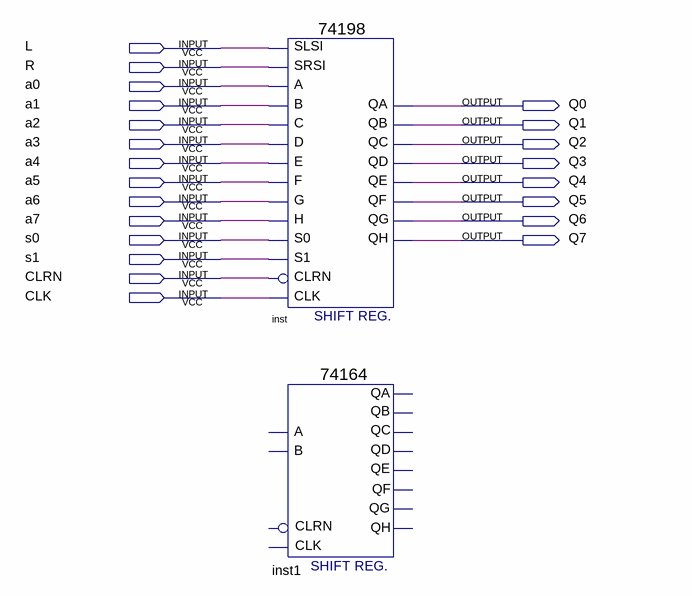
[diagram p0: schematic sheet]
// Quartus schematic mov.bdf as structural Verilog: 2 symbols, 22 pins
module mov (
  input  L,
  input  R,
  input  a0,
  input  a1,
  input  a2,
  input  a3,
  input  a4,
  input  a5,
  input  a6,
  input  a7,
  input  s0,
  input  s1,
  input  CLRN,
  input  CLK,
  output Q0,
  output Q1,
  output Q2,
  output Q3,
  output Q4,
  output Q5,
  output Q6,
  output Q7
);

  \74198  inst (
    .A(a0), .SRSI(R), .SLSI(L), .E(a4), .S0(s0), .B(a1), .C(a2), .D(a3), .H(a7), .G(a6), .CLRN(CLRN),
    .CLK(CLK), .F(a5), .S1(s1), .QD(Q3), .QC(Q2), .QH(Q7), .QA(Q0), .QB(Q1), .QE(Q4), .QF(Q5), .QG(Q6));
  \74164  inst1 ();  // open: CLRN, CLK, B, A, QD, QC, QA, QF, QH, QG, QE, QB
endmodule
